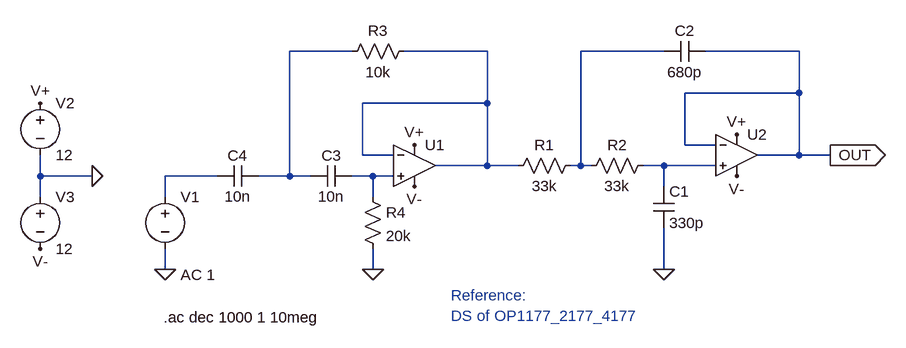
[diagram p0: schematic KRC.asc]
KRC.asc, the LTspice schematic file:
Version 4
SHEET 1 880 804
WIRE -208 -16 -304 -16
WIRE 0 -16 -128 -16
WIRE 272 -16 144 -16
WIRE 480 -16 336 -16
WIRE 480 48 480 -16
WIRE 480 48 304 48
WIRE 0 64 0 -16
WIRE 0 64 -192 64
WIRE 304 128 304 48
WIRE 352 128 304 128
WIRE -192 144 -192 64
WIRE -144 144 -192 144
WIRE 480 144 480 48
WIRE 480 144 416 144
WIRE 528 144 480 144
WIRE 0 160 0 64
WIRE 0 160 -80 160
WIRE 48 160 0 160
WIRE 144 160 144 -16
WIRE 144 160 128 160
WIRE 160 160 144 160
WIRE 272 160 240 160
WIRE 352 160 272 160
WIRE -688 176 -688 144
WIRE -608 176 -688 176
WIRE -416 176 -496 176
WIRE -304 176 -304 -16
WIRE -304 176 -352 176
WIRE -272 176 -304 176
WIRE -176 176 -208 176
WIRE -144 176 -176 176
WIRE 272 192 272 160
WIRE -688 208 -688 176
WIRE -496 208 -496 176
WIRE -176 208 -176 176
WIRE -496 320 -496 288
WIRE -176 320 -176 288
WIRE 272 320 272 256
FLAG 272 320 0
FLAG -176 320 0
FLAG -112 128 V+
FLAG 384 112 V+
FLAG -112 192 V-
FLAG 384 176 V-
FLAG -496 320 0
FLAG -608 176 0
FLAG -688 64 V+
FLAG -688 288 V-
FLAG 528 144 OUT
IOPIN 528 144 Out
SYMBOL res 32 176 R270
WINDOW 0 32 56 VTop 0
WINDOW 3 0 56 VBottom 0
SYMATTR InstName R1
SYMATTR Value 33k
SYMBOL res 144 176 R270
WINDOW 0 32 56 VTop 0
WINDOW 3 0 56 VBottom 0
SYMATTR InstName R2
SYMATTR Value 33k
SYMBOL cap 256 192 R0
SYMATTR InstName C1
SYMATTR Value 330p
SYMBOL cap 272 0 R270
WINDOW 0 32 32 VTop 0
WINDOW 3 0 32 VBottom 0
SYMATTR InstName C2
SYMATTR Value 680p
SYMBOL res -224 0 R270
WINDOW 0 32 56 VTop 0
WINDOW 3 0 56 VBottom 0
SYMATTR InstName R3
SYMATTR Value 10k
SYMBOL cap -272 192 R270
WINDOW 0 32 32 VTop 0
WINDOW 3 0 32 VBottom 0
SYMATTR InstName C3
SYMATTR Value 10n
SYMBOL cap -416 192 R270
WINDOW 0 32 32 VTop 0
WINDOW 3 0 32 VBottom 0
SYMATTR InstName C4
SYMATTR Value 10n
SYMBOL res -192 192 R0
SYMATTR InstName R4
SYMATTR Value 20k
SYMBOL voltage -496 192 R0
WINDOW 123 24 136 Left 0
WINDOW 39 0 0 Left 0
SYMATTR InstName V1
SYMATTR Value ""
SYMATTR Value2 AC 1
SYMBOL voltage -688 48 R0
WINDOW 123 0 0 Left 0
WINDOW 39 0 0 Left 0
SYMATTR InstName V2
SYMATTR Value 12
SYMBOL voltage -688 192 R0
WINDOW 123 0 0 Left 0
WINDOW 39 0 0 Left 0
SYMATTR InstName V3
SYMATTR Value 12
SYMBOL Opamps\\UniversalOpamp2 -112 160 R0
SYMATTR InstName U1
SYMBOL Opamps\\UniversalOpamp2 384 144 R0
SYMATTR InstName U2
TEXT -498 394 Left 0 !.ac dec 1000 1 10meg
TEXT -56 360 Left 0 ;Reference:\nDS of OP1177_2177_4177

The netlist it stands for:
* KRC.asc
R1 N002 N003 33k
R2 N003 N004 33k
C1 N004 0 330p
C2 N003 OUT 680p
R3 N001 N002 10k
C3 N001 N006 10n
C4 N005 N001 10n
R4 N006 0 20k
V1 N005 0 AC 1
V2 V+ 0 12
V3 0 V- 12
XU1 N006 N002 V+ V- N002 level.2 Avol=1Meg GBW=10Meg Slew=10Meg ilimit=25m rail=0 Vos=0 phimargin=45 en=0 enk=0 in=0 ink=0 Rin=500Meg  ; pins IN+ IN- V+ V- OUT
XU2 N004 OUT V+ V- OUT level.2 Avol=1Meg GBW=10Meg Slew=10Meg ilimit=25m rail=0 Vos=0 phimargin=45 en=0 enk=0 in=0 ink=0 Rin=500Meg  ; pins IN+ IN- V+ V- OUT
.ac dec 1000 1 10meg
* Reference:
* DS of OP1177_2177_4177
.lib UniversalOpamps2.sub
.backanno
.end